# Altium schematic sheet HIVE_BOARD_DEBUG.SchDoc
size Tabloid; SheetNumber: 10; SheetTotal: 12; Size: 11x17; Sheet_Name: DEBUG
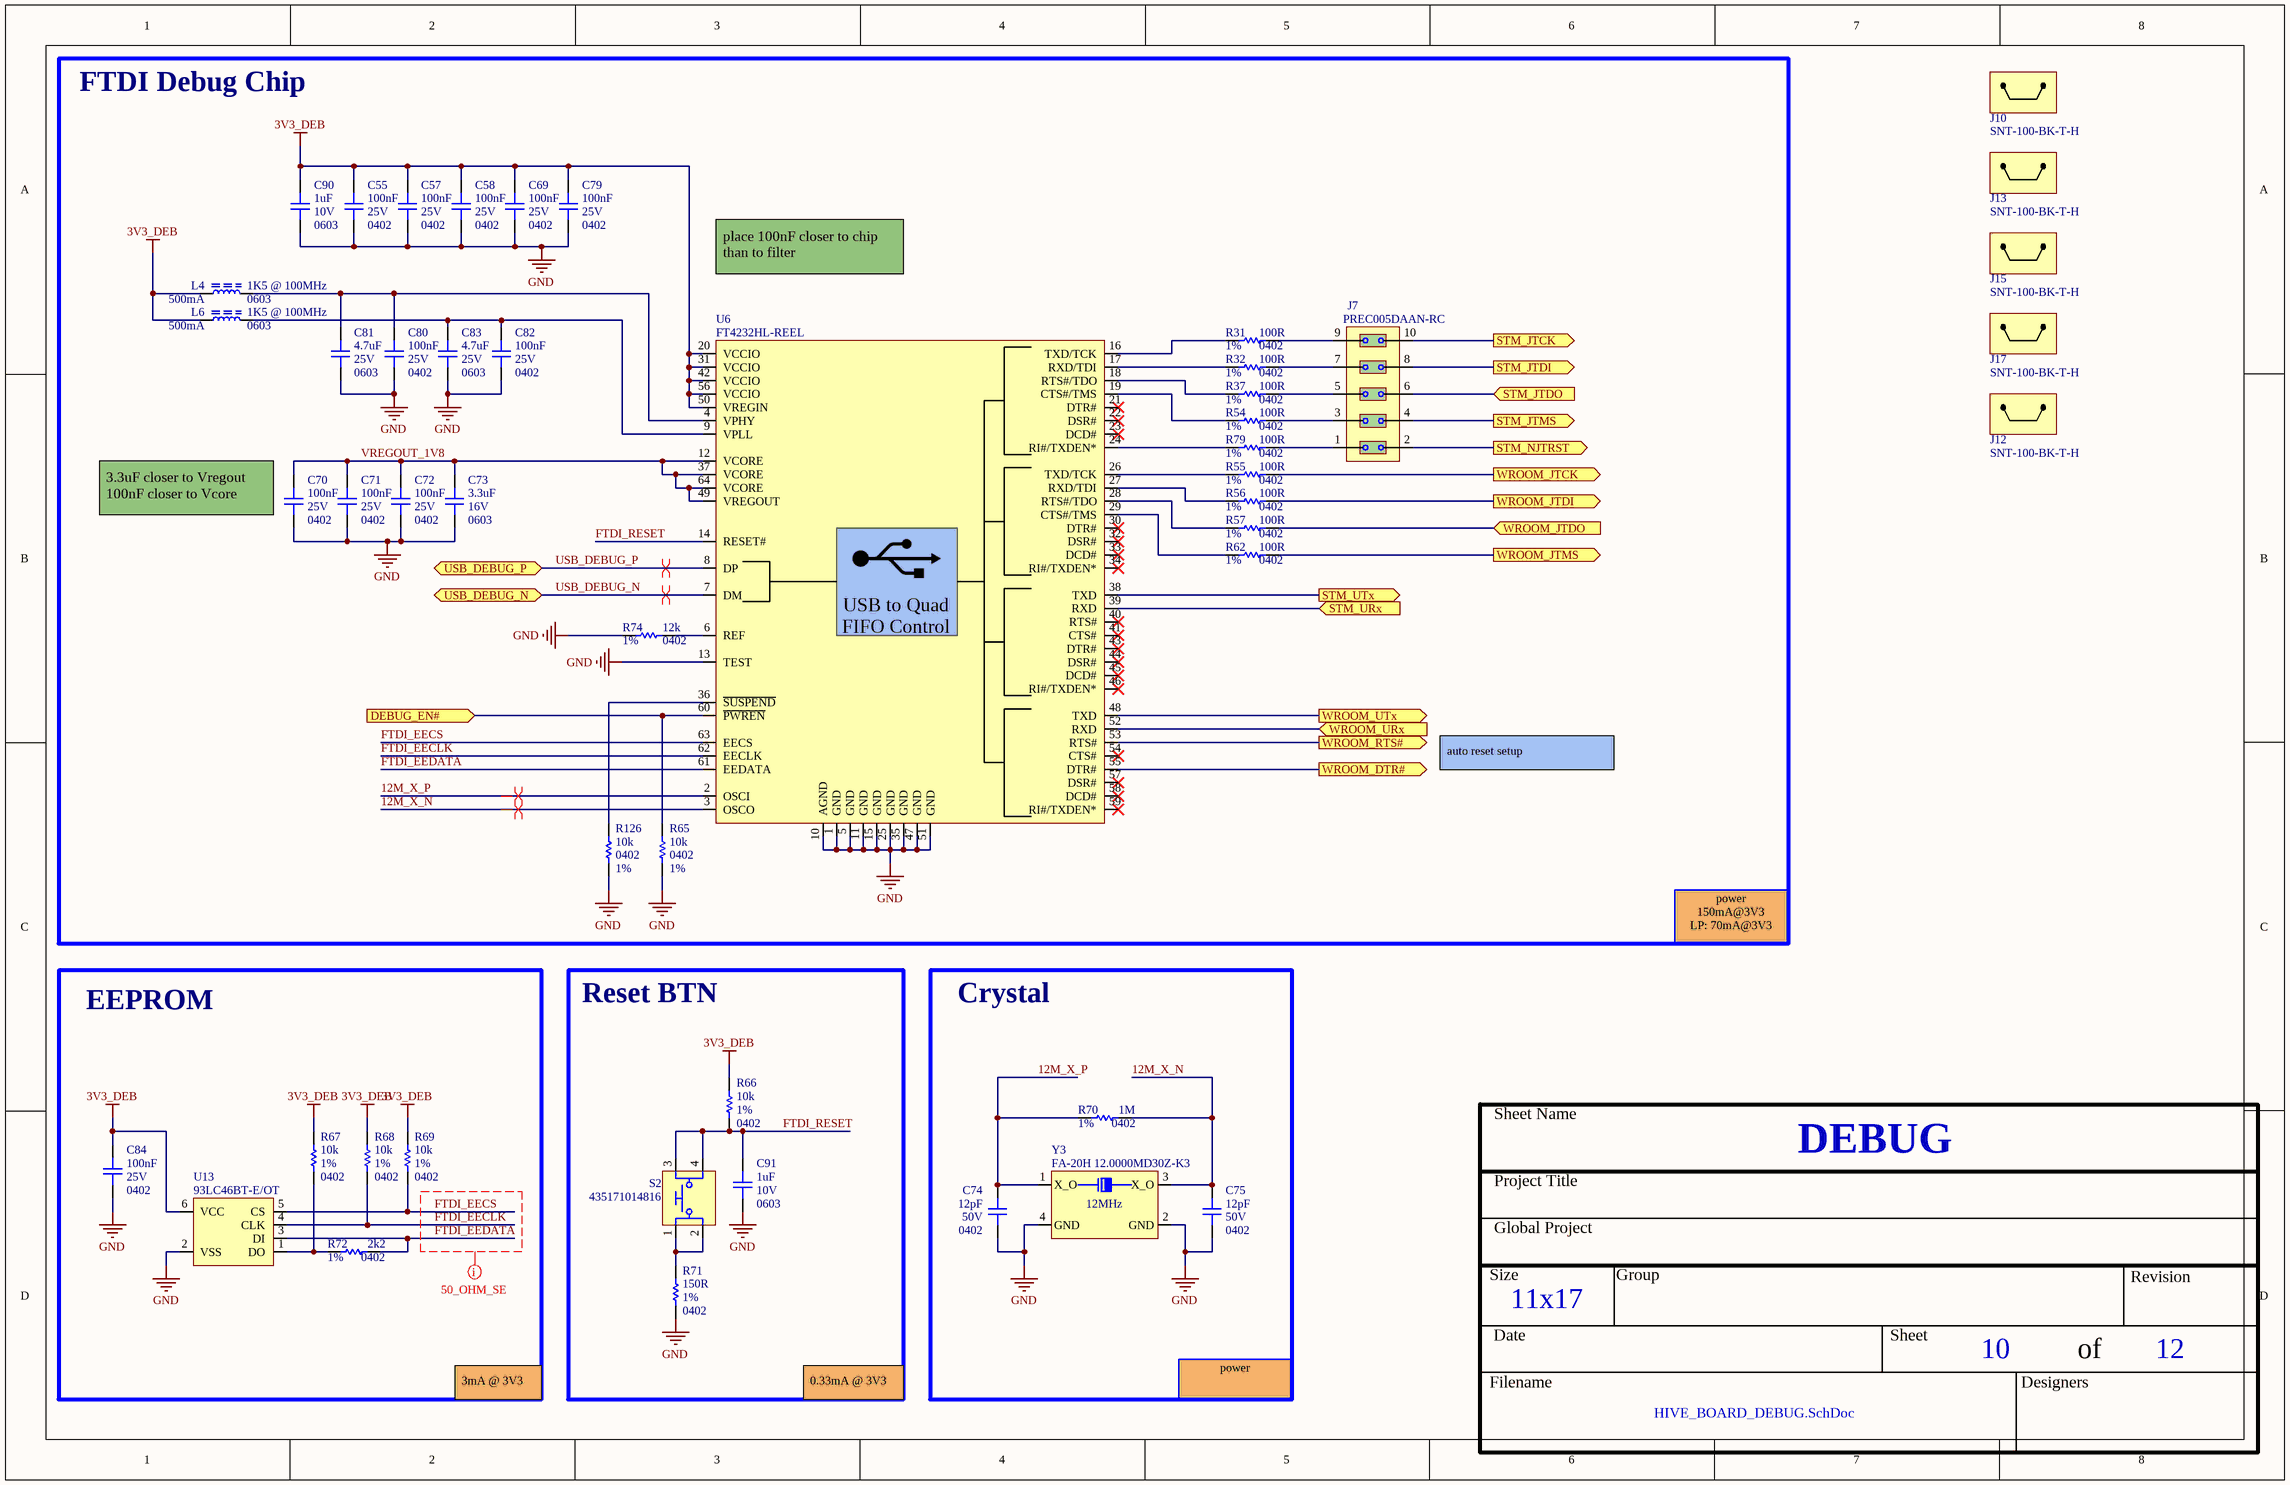
[diagram p0: HIVE_BOARD_DEBUG.SchDoc]

## Parts
C55  value 100nF  Package: 0402  Voltage Rating: 25V  [CAP_CER_0402]  (hidden comment: CGA2B3X7R1E104K050BB)
C57  value 100nF  Package: 0402  Voltage Rating: 25V  [CAP_CER_0402]  (hidden comment: CGA2B3X7R1E104K050BB)
C58  value 100nF  Package: 0402  Voltage Rating: 25V  [CAP_CER_0402]  (hidden comment: CGA2B3X7R1E104K050BB)
C69  value 100nF  Package: 0402  Voltage Rating: 25V  [CAP_CER_0402]  (hidden comment: CGA2B3X7R1E104K050BB)
C70  value 100nF  Package: 0402  Voltage Rating: 25V  [CAP_CER_0402]  (hidden comment: CGA2B3X7R1E104K050BB)
C71  value 100nF  Package: 0402  Voltage Rating: 25V  [CAP_CER_0402]  (hidden comment: CGA2B3X7R1E104K050BB)
C72  value 100nF  Package: 0402  Voltage Rating: 25V  [CAP_CER_0402]  (hidden comment: CGA2B3X7R1E104K050BB)
C73  value 3.3uF  Package: 0603  Voltage Rating: 16V  [CAP_CER_0603]  (hidden comment: C1608X5R1C335K080AC)
C74  value 12pF  Package: 0402  Voltage Rating: 50V  [CAP_CER_0402]  (hidden comment: CC0402JRNPO9BN120)
C75  value 12pF  Package: 0402  Voltage Rating: 50V  [CAP_CER_0402]  (hidden comment: CC0402JRNPO9BN120)
C79  value 100nF  Package: 0402  Voltage Rating: 25V  [CAP_CER_0402]  (hidden comment: CGA2B3X7R1E104K050BB)
C80  value 100nF  Package: 0402  Voltage Rating: 25V  [CAP_CER_0402]  (hidden comment: CGA2B3X7R1E104K050BB)
C81  value 4.7uF  Package: 0603  Voltage Rating: 25V  [CAP_CER_0603]  (hidden comment: CL10A475MA8NQNC)
C82  value 100nF  Package: 0402  Voltage Rating: 25V  [CAP_CER_0402]  (hidden comment: CGA2B3X7R1E104K050BB)
C83  value 4.7uF  Package: 0603  Voltage Rating: 25V  [CAP_CER_0603]  (hidden comment: CL10A475MA8NQNC)
C84  value 100nF  Package: 0402  Voltage Rating: 25V  [CAP_CER_0402]  (hidden comment: CGA2B3X7R1E104K050BB)
C90  value 1uF  Package: 0603  Voltage Rating: 10V  [CAP_CER_0603]  (hidden comment: C0603C105K8PACTU)
C91  value 1uF  Package: 0603  Voltage Rating: 10V  [CAP_CER_0603]  (hidden comment: C0603C105K8PACTU)
J7  PREC005DAAN-RC  [CON_HDR_PREC009DAAN-RC]
J10  SNT-100-BK-T-H  [CON_JMP_SNT-100-BK-T-H]
J12  SNT-100-BK-T-H  [CON_JMP_SNT-100-BK-T-H]
J13  SNT-100-BK-T-H  [CON_JMP_SNT-100-BK-T-H]
J15  SNT-100-BK-T-H  [CON_JMP_SNT-100-BK-T-H]
J17  SNT-100-BK-T-H  [CON_JMP_SNT-100-BK-T-H]
L4  value 1K5 @ 100MHz  Current Rating: 500mA  Package: 0603  [FER_0603]  (hidden comment: BLM18HE152SN1D)
L6  value 1K5 @ 100MHz  Current Rating: 500mA  Package: 0603  [FER_0603]  (hidden comment: BLM18HE152SN1D)
R31  value 100R  Tolerance: 1%  Package: 0402  [RES_0402]  (hidden comment: RC0402FR-07100RP)
R32  value 100R  Tolerance: 1%  Package: 0402  [RES_0402]  (hidden comment: RC0402FR-07100RP)
R37  value 100R  Tolerance: 1%  Package: 0402  [RES_0402]  (hidden comment: RC0402FR-07100RP)
R54  value 100R  Tolerance: 1%  Package: 0402  [RES_0402]  (hidden comment: RC0402FR-07100RP)
R55  value 100R  Tolerance: 1%  Package: 0402  [RES_0402]  (hidden comment: RC0402FR-07100RP)
R56  value 100R  Tolerance: 1%  Package: 0402  [RES_0402]  (hidden comment: RC0402FR-07100RP)
R57  value 100R  Tolerance: 1%  Package: 0402  [RES_0402]  (hidden comment: RC0402FR-07100RP)
R62  value 100R  Tolerance: 1%  Package: 0402  [RES_0402]  (hidden comment: RC0402FR-07100RP)
R65  value 10k  Tolerance: 1%  Package: 0402  [RES_0402]  (hidden comment: RC0402FR-0710KL)
R66  value 10k  Tolerance: 1%  Package: 0402  [RES_0402]  (hidden comment: RC0402FR-0710KL)
R67  value 10k  Tolerance: 1%  Package: 0402  [RES_0402]  (hidden comment: RC0402FR-0710KL)
R68  value 10k  Tolerance: 1%  Package: 0402  [RES_0402]  (hidden comment: RC0402FR-0710KL)
R69  value 10k  Tolerance: 1%  Package: 0402  [RES_0402]  (hidden comment: RC0402FR-0710KL)
R70  value 1M  Tolerance: 1%  Package: 0402  [RES_0402]  (hidden comment: RC0402FR-071ML)
R71  value 150R  Tolerance: 1%  Package: 0402  [RES_0402]  (hidden comment: RC0402FR-07150RL)
R72  value 2k2  Tolerance: 1%  Package: 0402  [RES_0402]  (hidden comment: RC0402FR-072K2L)
R74  value 12k  Tolerance: 1%  Package: 0402  [RES_0402]  (hidden comment: RC0402FR-0712KL)
R79  value 100R  Tolerance: 1%  Package: 0402  [RES_0402]  (hidden comment: RC0402FR-07100RP)
R126  value 10k  Tolerance: 1%  Package: 0402  [RES_0402]  (hidden comment: RC0402FR-0710KL)
S2  435171014816  [SWI_TACT_435171014816]
U6  FT4232HL-REEL  [COM_USB_FT4232HL-REEL]
U13  93LC46BT-E/OT  [MEM_EEPROM_93LC46BT-E/OT]
Y3  FA-20H 12.0000MD30Z-K3  [CRY_FA-20H]

## Blocks framed on the sheet
FTDI Debug Chip: C55 C57 C58 C69-C73 C79-C83 C90 J7 L4 L6 R31 R32 R37 R54-R57 R62 R65 R74 R79 R126 U6
EEPROM: C84 R67-R69 R72 U13
Reset BTN: C91 R66 R71 S2
Crystal: C74 C75 R70 Y3

## Ports
DEBUG_EN# (in), STM_JTCK (out), STM_JTDI (out), STM_JTDO (in), STM_JTMS (out), STM_NJTRST (out), STM_URx (in), STM_UTx (out), USB_DEBUG_N (bidir), USB_DEBUG_P (bidir), WROOM_DTR# (out), WROOM_JTCK (out), WROOM_JTDI (out), WROOM_JTDO (in), WROOM_JTMS (out), WROOM_RTS# (out), WROOM_URx (in), WROOM_UTx (out)

## Nets
3V3_DEB: C55.1 C57.1 C58.1 C69.1 C79.1 C84.1 C90.1 L4.1 L6.1 R66.2 R67.2 R68.2 R69.2 U6.20(VCCIO) U6.31(VCCIO) U6.42(VCCIO) U6.50(VREGIN) U6.56(VCCIO) U13.6(VCC)
GND: C55.2 C57.2 C58.2 C69.2 C70.2 C71.2 C72.2 C73.1 C74.1 C75.1 C79.2 C80.2 C81.1 C82.2 C83.1 C84.2 C90.2 C91.2 R65.2 R71.1 R74.1 R126.2 U6.1(GND) U6.5(GND) U6.10(AGND) U6.11(GND) U6.13(TEST) U6.15(GND) U6.25(GND) U6.35(GND) U6.47(GND) U6.51(GND) U13.2(VSS) Y3.2(GND) Y3.4(GND)
12M_X_N: C75.2 R70.1 U6.3(OSCO) Y3.3(X_O)
12M_X_P: C74.2 R70.2 U6.2(OSCI) Y3.1(X_O)
DEBUG_EN#: R65.1 U6.60(~{PWREN}) ; port DEBUG_EN#
FTDI_EECLK: R68.1 U6.62(EECLK) U13.4(CLK)
FTDI_EECS: R69.1 U6.63(EECS) U13.5(CS)
FTDI_EEDATA: R72.1 U6.61(EEDATA) U13.3(DI)
FTDI_RESET: C91.1 R66.1 S2.3 S2.4 U6.14(RESET#)
STM_JTCK: J7.10 ; port STM_JTCK
STM_JTDI: J7.8 ; port STM_JTDI
STM_JTDO: J7.6 ; port STM_JTDO
STM_JTMS: J7.4 ; port STM_JTMS
STM_NJTRST: J7.2 ; port STM_NJTRST
STM_URx: U6.39(RXD) ; port STM_URx
STM_UTx: U6.38(TXD) ; port STM_UTx
USB_DEBUG_N: U6.7(DM) ; port USB_DEBUG_N
USB_DEBUG_P: U6.8(DP) ; port USB_DEBUG_P
VREGOUT_1V8: C70.1 C71.1 C72.1 C73.2 U6.12(VCORE) U6.37(VCORE) U6.49(VREGOUT) U6.64(VCORE)
WROOM_DTR#: U6.55(DTR#) ; port WROOM_DTR#
WROOM_JTCK: R55.1 ; port WROOM_JTCK
WROOM_JTDI: R56.1 ; port WROOM_JTDI
WROOM_JTDO: R57.1 ; port WROOM_JTDO
WROOM_JTMS: R62.1 ; port WROOM_JTMS
WROOM_RTS#: U6.53(RTS#) ; port WROOM_RTS#
WROOM_URx: U6.52(RXD) ; port WROOM_URx
WROOM_UTx: U6.48(TXD) ; port WROOM_UTx
NetC80_1: C80.1 C81.2 L4.2 U6.4(VPHY)
NetC82_1: C82.1 C83.2 L6.2 U6.9(VPLL)
NetJ7_1: J7.1 R79.1
NetJ7_3: J7.3 R54.1
NetJ7_5: J7.5 R37.1
NetJ7_7: J7.7 R32.1
NetJ7_9: J7.9 R31.1
NetR31_2: R31.2 U6.16(TXD/TCK)
NetR32_2: R32.2 U6.17(RXD/TDI)
NetR37_2: R37.2 U6.18(RTS#/TDO)
NetR54_2: R54.2 U6.19(CTS#/TMS)
NetR55_2: R55.2 U6.26(TXD/TCK)
NetR56_2: R56.2 U6.27(RXD/TDI)
NetR57_2: R57.2 U6.28(RTS#/TDO)
NetR62_2: R62.2 U6.29(CTS#/TMS)
NetR67_1: R67.1 R72.2 U13.1(DO)
NetR71_2: R71.2 S2.1 S2.2
NetR74_2: R74.2 U6.6(REF)
NetR79_2: R79.2 U6.24(RI#/TXDEN*)
NetR126_1: R126.1 U6.36(~{SUSPEND})

Not connected (* = marked no-connect by the designer): U6 21(DTR#)* 22(DSR#)* 23(DCD#)* 30(DTR#)* 32(DSR#)* 33(DCD#)* 34(RI#/TXDEN*)* 40(RTS#)* 41(CTS#)* 43(DTR#)* 44(DSR#)* 45(DCD#)* 46(RI#/TXDEN*)* 54(CTS#)* 57(DSR#)* 58(DCD#)* 59(RI#/TXDEN*)*

## Layout directives
differential pair; net class DIFF_90: USB_DEBUG_N, USB_DEBUG_P
net class SE_50: FTDI_EECLK, FTDI_EECS, FTDI_EEDATA
differential pair; differential pair class DIFF_100: 12M_X_N, 12M_X_P

## Notes on the sheet
- place 100nF closer to chip than to filter
- (near C70) 3.3uF closer to Vregout
  100nF closer to Vcore
- auto reset setup
- power
  150mA@3V3
  LP: 70mA@3V3
- 3mA @ 3V3
- 0.33mA @ 3V3
- power
- Sheet Name
- Project Title
- Global Project
- Size
- Group
- Revision
- Date
- Sheet
- of
- Filename
- Designers
- (in symbol COM_USB_FT4232HL-REEL) / USB to Quad / FIFO Control

## Library data of the parts
C55 C57 C58 C69-C72 C79 C80 C82 C84 = CAP_CER_CGA2B3X7R1E104K050BB: CAP - CER 0.1µF 10% 25V X7R - 0402; Manufacturer #1: TDK Corporation; GRAMS Lib Spec: 2.8; Magnetic Material: Unknown; Polarized: NO; Assembly Type: SMD; CreatedBy/Date: Nicolas Roy 2018-11-07; Current Rating: *; HelpURL: https://product.tdk.com/info/en/catalog/datasheets/mlcc_automotive_general_en.pdf; Manufacturer #2: *; Note: *; Part Number #1: CGA2B3X7R1E104K050BB; Part Number #2: *; Power Max: *; Temperature: -55°C ~ 125°C; Tolerance: 10%; VerifiedBy: Nicolas V. (2019-01-22); Supplier 1: Digi-Key; Supplier Part Number 1: 445-6902-1-ND; Cryo: UNKNOWN
C73 = CAP_CER_C1608X5R1C335K080AC: CAP - CER 3.3µF ±10% 16V Ceramic Capacitor X5R 0603 (1608 Metric); Manufacturer #1: TDK Corporation; GRAMS Lib Spec: 2.8; Magnetic Material: Unknown; Polarized: No; Tolerance: 10%; Current Rating: *; Power Max: *; HelpURL: https://product.tdk.com/en/system/files?file=dam/doc/product/capacitor/ceramic/mlcc/catalog/mlcc_commercial_general_en.pdf; CreatedBy/Date: Hubert Dube - 16/03/2021; VerifiedBy: Philippe Arsenault - 2021/03/16; Temperature: -55°C ~ 85°C; Manufacturer #2: *; Note: *; Assembly Type: SMD; Part Number #2: *; Part Number #1: C1608X5R1C335K080AC; Cryo: UNKNOWN; Supplier 1: Digi-Key; Supplier Part Number 1: 445-7476-1-ND
C74 C75 = CAP_CER_CC0402JRNPO9BN120: CAP - CER 12pF 50V ±5% C0G, NP0 - 0402; Manufacturer #1: Yageo; GRAMS Lib Spec: 2.8; Magnetic Material: Unknown; Polarized: NO; Assembly Type: SMD; CreatedBy/Date: Philippe Arsenault/ 2020-07-24; Current Rating: *; HelpURL: https://www.yageo.com/upload/media/product/productsearch/datasheet/mlcc/UPY-GP_NP0_16V-to-50V_18.pdf; Manufacturer #2: *; Note: *; Part Number #1: CC0402JRNPO9BN120; Part Number #2: *; Power Max: *; Temperature: -55°C ~ 125°C; Tolerance: ±5%; VerifiedBy: Louis-Daniel Gaulin / 2020-07-29; Cryo: UNKNOWN; Supplier 1: Digi-Key; Supplier Part Number 1: 311-1016-1-ND
C81 C83 = CAP_CER_CL10A475MA8NQNC: CAP - CER 4.7µF 20% 25V X5R - 0603; Manufacturer #1: Samsung Electro-Mechanics; GRAMS Lib Spec: 2.8; Magnetic Material: Unknown; Polarized: NO; Assembly Type: SMD; CreatedBy/Date: Nicolas Roy 2018-11-21; Current Rating: *; HelpURL: http://www.samsungsem.com/kr/support/product-search/mlcc/__icsFiles/afieldfile/2018/06/20/CL10A475MA8NQNC.pdf; Manufacturer #2: *; Note: *; Part Number #1: CL10A475MA8NQNC; Part Number #2: *; Power Max: *; Temperature: -55°C ~ 85°C; Tolerance: 20%; VerifiedBy: Nicolas V. (2019-01-22); Supplier 1: Digi-Key; Supplier Part Number 1: 1276-1903-1-ND; Cryo: UNKNOWN
C90 C91 = CAP_CER_C0603C105K8PACTU: CAP - CER 1uF 10V 10% X5R - 0603; Manufacturer #1: KEMET; GRAMS Lib Spec: 2.8; Magnetic Material: Unknown; Polarized: NO; Tolerance: 10%; Current Rating: *; Power Max: *; HelpURL: https://content.kemet.com/datasheets/KEM_C1006_X5R_SMD.pdf; CreatedBy/Date: Hubert Dube - 21/07/20; VerifiedBy: Louis-Daniel Gaulin - 21/07/20; Temperature: -55°C ~ 85°C; Manufacturer #2: *; Assembly Type: SMD; Part Number #2: *; Part Number #1: C0603C105K8PACTU; Cryo: UNKNOWN; Supplier 1: Digi-Key; Supplier Part Number 1: 399-3118-1-ND
J7 = CON_HDR_PREC005DAAN-RC: CON - Connector Header Through Hole 10 position 0.100" (2.54mm); Manufacturer #1: Sullins Connector Solutions; Value: 5x2; Current Rating: 3A; GRAMS Lib Spec: 2.8; Magnetic Material: Unknown; Polarized: Yes; Tolerance: *; Voltage Rating: *; Power Max: *; HelpURL: https://drawings-pdf.s3.amazonaws.com/11636.pdf; VerifiedBy: Louis-Daniel Gaulin / 08-04-2021; Temperature: -40°C ~ 105°C; Package: TH 2x5; Manufacturer #2: *; Assembly Type: TH; Part Number #2: *; Part Number #1: PREC005DAAN-RC; CreatedBy/Date: Philippe Arsenault/2021-03-27; Supplier 1: Digi-Key; Supplier Part Number 1: S2012EC-05-ND
J10 J12 J13 J15 J17 = CON_JMP_SNT-100-BK-T-H: CON - CONN SHUNT - MEC; Manufacturer #1: Samtec Inc.; Voltage Rating: 450 VAC; Current Rating: 4.3A; GRAMS Lib Spec: 2.8; Magnetic Material: UNKNOWN; Polarized: NO; Value: *; Tolerance: *; Power Max: *; HelpURL: http://suddendocs.samtec.com/catalog_english/snt.pdf; CreatedBy/Date: Arnaud Samson - 09/07/18; VerifiedBy: Jonathan Bouchard 2018-07-12; Temperature: -55 °C to +125 °C; Package: MEC; Manufacturer #2: *; Note: *; Assembly Type: MANUAL; Part Number #2: *; Part Number #1: SNT-100-BK-T-H; Supplier 1: Digi-Key; Supplier Part Number 1: SAM8972-ND
L4 L6 = FER_BLM18HE152SN1D: FER - 1.5 kOhms @ 100MHz 1 Signal Line Ferrite Bead 0603 (1608 Metric) 500mA 500mOhm DC; Manufacturer #1: Murata Electronics; GRAMS Lib Spec: 2.8; Magnetic Material: Unknown; Polarized: No; Tolerance: *; Voltage Rating: *; Power Max: *; HelpURL: https://www.murata.com/en-us/products/productdata/8796741599262/ENFA0004.pdf; CreatedBy/Date: Hubert Dube - 16/03/2021; VerifiedBy: Philippe Arsenault - 2021-03-16; Temperature: -55°C ~ 125°C; Assembly Type: SMD; Part Number #2: *; Part Number #1: BLM18HE152SN1D; Cryo: UNKNOWN; Supplier 1: Digi-Key; Supplier Part Number 1: 490-5216-1-ND
R31 R32 R37 R54-R57 R62 R79 = RES_RC0402FR-07100RP: RES - 100R OHM 1% 1/16W - 0402; Manufacturer #1: Yageo; GRAMS Lib Spec: 2.8; Magnetic Material: YES; Polarized: NO; Voltage Rating: 50V; Cryo: UNKNOWN; Assembly Type: SMD; CreatedBy/Date: Jonathan Bouchard 2018-07-05; Current Rating: *; HelpURL: http://www.yageo.com/documents/recent/PYu-RC_Group_51_RoHS_L_9.pdf; Manufacturer #2: *; Note: *; Part Number #1: RC0402FR-07100RP; Part Number #2: *; Power Max: 1/16W; Temperature: -55°C ~ 155°C; VerifiedBy: Arnaud Samson 16-07-18; Supplier 1: Digi-Key; Supplier Part Number 1: YAG1248CT-ND
R65-R69 R126 = RES_RC0402FR-0710KL: RES - 10K OHMS 1% 1/16W - 0402; Manufacturer #1: Yageo; GRAMS Lib Spec: 2.8; Magnetic Material: UNKNOWN; Polarized: NO; Voltage Rating: 50V; Assembly Type: SMD; CreatedBy/Date: Nicolas V. (2018-11-20); Current Rating: *; HelpURL: http://www.yageo.com/documents/recent/PYu-RC_Group_51_RoHS_L_9.pdf; Manufacturer #2: *; Note: *; Part Number #1: RC0402FR-0710KL; Part Number #2: *; Power Max: 1/16W; Temperature: -55°C ~ 155°C; VerifiedBy: Nicolas V. (2018-11-20); Supplier 1: Digi-Key; Supplier Part Number 1: 311-10.0KLRCT-ND; Cryo: UNKNOWN
R70 = RES_RC0402FR-071ML: RES - 1 MOhms ±1% 0.063W, 1/16W Chip Resistor 0402 (1005 Metric) Moisture Resistant Thick Film; Manufacturer #1: Yageo; GRAMS Lib Spec: 2.8c; Magnetic Material: Unknown; Polarized: No; Voltage Rating: 50V; Assembly Type: SMD; CreatedBy/Date: Hubert Dube 16/03/2021; Current Rating: *; HelpURL: https://www.yageo.com/upload/media/product/productsearch/datasheet/rchip/PYu-RC_Group_51_RoHS_L_11.pdf; Manufacturer #2: *; Note: *; Part Number #1: RC0402FR-071ML; Part Number #2: *; Power Max: 1/16W; Temperature: -55°C ~ 155°C; VerifiedBy: Philippe Arsenault - 2021/03/16; Supplier 1: Digi-Key; Supplier Part Number 1: 311-1.00MLRCT-ND
R71 = RES_RC0402FR-07150RL: RES - 150R 1% 1/16W - 0402; Manufacturer #1: Yageo; GRAMS Lib Spec: 2.8; Magnetic Material: Unknown; Polarized: No; Voltage Rating: 50V; Assembly Type: SMD; CreatedBy/Date: Jonathan Bouchard 2019-03-25; Current Rating: *; HelpURL: http://www.yageo.com/documents/recent/PYu-RC_Group_51_RoHS_L_10.pdf; Manufacturer #2: *; Part Number #1: RC0402FR-07150RL; Part Number #2: *; Power Max: 1/16W; Temperature: -55°C ~ 155°C; VerifiedBy: Nicolas V. (2019-05-02); Supplier 1: Digi-Key; Supplier Part Number 1: 311-150LRCT-ND; Cryo: UNKNOWN
R72 = RES_RC0402FR-072K2L: RES - 2.2K 1% 1/16W - 0402; Manufacturer #1: Yageo; GRAMS Lib Spec: 2.8; Magnetic Material: Unknown; Polarized: No; Voltage Rating: 50V; Assembly Type: SMD; CreatedBy/Date: Keven Deslandes 2018-11-14; Current Rating: *; HelpURL: http://www.yageo.com/documents/recent/PYu-RC_Group_51_RoHS_L_10.pdf; Manufacturer #2: *; Part Number #1: RC0402FR-072K2L; Part Number #2: *; Power Max: 1/16W; Temperature: -55°C ~ 155°C; VerifiedBy: Caroline Paulin - 8 janv 2019; Supplier 1: Digi-Key; Supplier Part Number 1: 311-2.20KLRCT-ND; Cryo: UNKNOWN
R74 = RES_RC0402FR-0712KL: RES - 12k Ohms ±1% 0.063W, 1/16W Chip Resistor 0402 (1005 Metric) Moisture Resistant Thick Film; Manufacturer #1: Yageo; GRAMS Lib Spec: 2.8c; Magnetic Material: Unknown; Polarized: No; Voltage Rating: 50V; Assembly Type: SMD; CreatedBy/Date: Philippe Arsenault/2021-03-11; Current Rating: *; HelpURL: https://www.yageo.com/upload/media/product/productsearch/datasheet/rchip/PYu-RC_Group_51_RoHS_L_11.pdf; Manufacturer #2: *; Note: *; Part Number #1: RC0402FR-0712KL; Part Number #2: *; Power Max: 1/16W; Temperature: -55°C ~ 155°C; VerifiedBy: Hubert Dube - 19/03/2021; Supplier 1: Digi-Key; Supplier Part Number 1: 311-12.0KLRCT-ND
S2 = SWI_TACT_435171014816: SWI - SWITCH TACTILE SPST-NO 0.05A 12V -SMD; Manufacturer #1: Würth Elektronik; Current Rating: 50mA; Voltage rating: 12VDC; Polarized: No; Magnetic Material: UNKNOWN; GRAMS Lib Spec: 2.8; Manufacturer #2: *; Power Max: *; Value: SPST-NO; Part Number #1: 435171014816; Part Number #2: *; HelpURL: https://www.we-online.com/catalog/datasheet/435171014816.pdf; Supplier 1: Digi-Key; Supplier Part Number 1: 732-435171014816CT-ND; Assembly Type: SMD; Temperature: -40°C ~ 85°C; Package: SMD; CreatedBy/Date: Hubert Dube - 22/07/20; Tolerance: *; VerifiedBy: Louis-Daniel Gaulin / 12-11-2020; Cryo: UNKNOWN
U6 = COM_USB_FT4232HL-REEL: COM_USB - Bridge, USB to UART,FIFO USB 2.0 FIFO, JTAG Quad channel Interface -  64-LQFP (10x10); Manufacturer #1: FTDI, Future Technology Devices International Ltd; Voltage Rating: 3V ~ 3.6V (VCCIO), 1.62V ~ 1.98V (core); Current Rating: 220mA; Power Max: 800mW; GRAMS Lib Spec: 2.8; Magnetic Material: Unknown; Polarized: Yes; Value: *; Tolerance: *; HelpURL: https://www.ftdichip.com/Support/Documents/DataSheets/ICs/DS_FT4232H.pdf; VerifiedBy: Louis-Daniel Gaulin / 08-04-2021; Temperature: -40°C ~ 85°C; Package: 64-LQFP; Manufacturer #2: *; Assembly Type: SMD; Part Number #2: *; Part Number #1: FT4232HL-REEL; CreatedBy/Date: Philippe Arsenault/2021-04-07; Supplier 1: Digi-Key; Supplier Part Number 1: 768-1026-1-ND
U13 = MEM_EEPROM_93LC46BT-E/OT: EEPROM Memory IC 1Kb (128 x 8) SPI 2MHz  SOT-23-6; Manufacturer #1: Microchip Technology; Voltage Rating: 2.5V ~ 5.5V; GRAMS Lib Spec: 2.7; Magnetic Material: Unknown; Polarized: Yes; Value: 1Kb; Tolerance: *; Current Rating: *; Power Max: *; HelpURL: https://ww1.microchip.com/downloads/en/DeviceDoc/20001749K.pdf; VerifiedBy: Philippe Arsenault - 17/03/2021 + HD 19/03/2021; Temperature: -40°C ~ 125°C; Package: SOT-23-6; Manufacturer #2: *; Assembly Type: SMD; Part Number #2: *; Part Number #1: 93LC46BT-E/OT; CreatedBy/Date: Hubert Dube -  13/03/2021; Supplier 1: Digi-Key; Supplier Part Number 1: 93LC46BT-E/OTCT-ND
Y3 = CRY_FA-20H 12.0000MD30Z-K3: CRY - 12MHz ±30ppm Crystal 10pF 150 Ohms 4-SMD, No Lead; Manufacturer #1: EPSON; Voltage Rating: 1.8V ~ 3.3V; GRAMS Lib Spec: 2.8; Magnetic Material: Unknown; Polarized: Yes; Value: 12MHz; Tolerance: ±30ppm; Current Rating: *; Power Max: *; HelpURL: https://support.epson.biz/td/api/doc_check.php?dl=brief_FA-20H&lang=en; CreatedBy/Date: Hubert Dube - 13/03/2021; VerifiedBy: Philippe Arsenault - 2021/03/16; Temperature: -40°C ~ 85°C; Package: 4-SMD, No Lead; Manufacturer #2: *; Note: *; Assembly Type: SMD; Part Number #2: *; Part Number #1: FA-20H 12.0000MD30Z-K3; Cryo: UNKNOWN; Supplier 1: Digi-Key; Supplier Part Number 1: SER4113CT-ND